# EAGLE schematic Mainboard_schematic (EAGLE 9.7.0)
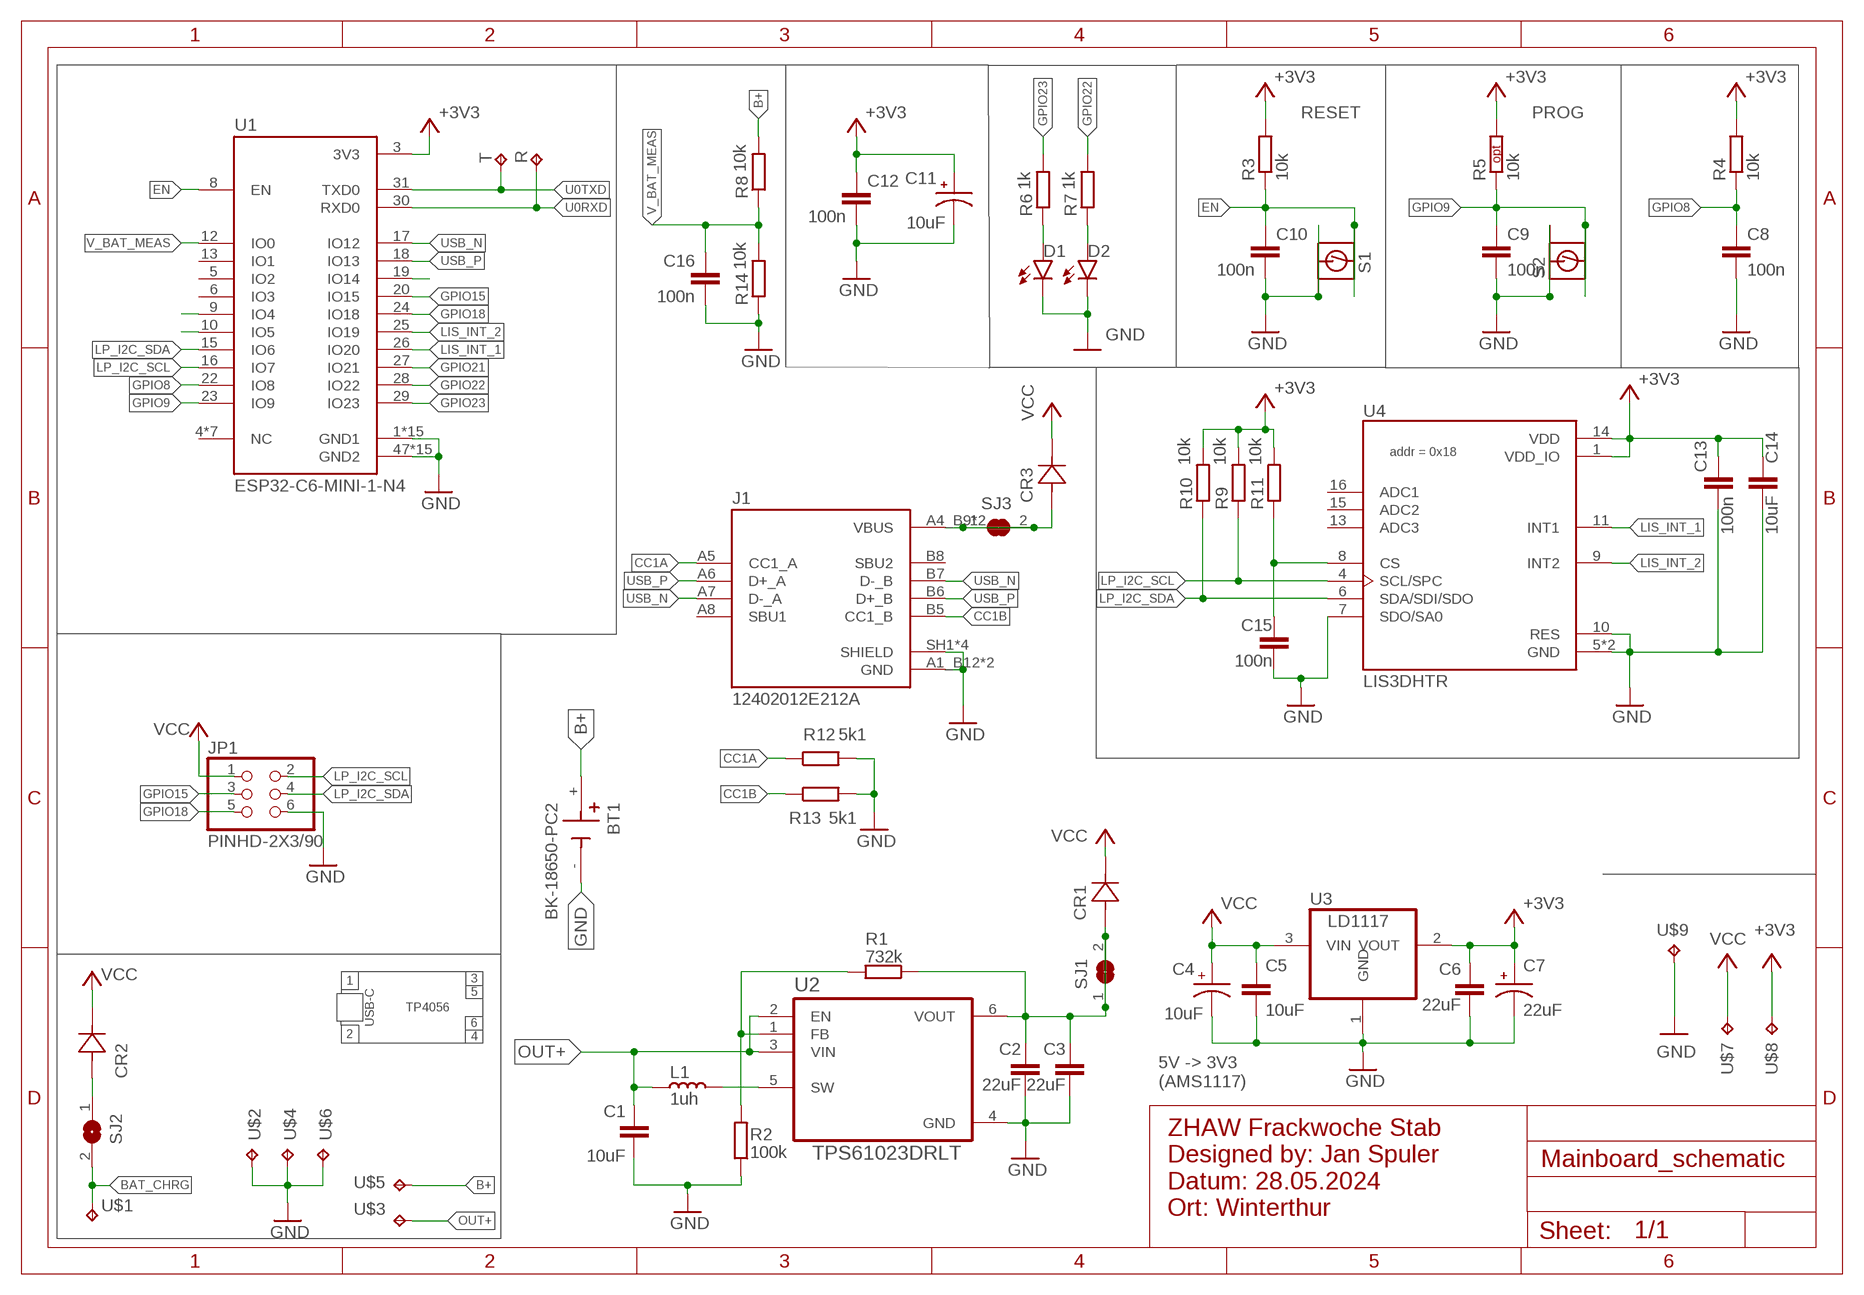
[diagram p0: schematic, sheet 1]

## Parts
BT1  BK-18650-PC2  [BAT_BK-18650-PC2]
C1  10uF  C-EUC0603  [C0603]
C2  22uF  C-EUC0603  [C0603]
C3  22uF  C-EUC0603  [C0603]
C4  10uF  50SVPF10M  [CAP_50SVPF10M]
C5  10uF  C-EUC0603  [C0603]
C6  22uF  C-EUC0603  [C0603]
C7  22uF  50SVPF10M  [CAP_50SVPF10M]
C8  100n  C-EUC0603  [C0603]
C9  100n  C-EUC0603  [C0603]
C10  100n  C-EUC0603  [C0603]
C11  10uF  50SVPF10M  [CAP_50SVPF10M]
C12  100n  C-EUC0603  [C0603]
C13  100n  C-EUC0603  [C0603]
C14  10uF  C-EUC0603  [C0603]
C15  100n  C-EUC0603  [C0603]
C16  100n  C-EUC0603  [C0603]
CR1  LSM115JE3/TR13DO-214BA_MCH-M  [DO-214BA_MCH-M]
CR2  LSM115JE3/TR13DO-214BA_MCH-M  [DO-214BA_MCH-M]
CR3  LSM115JE3/TR13DO-214BA_MCH-M  [DO-214BA_MCH-M]
D1  LED_RED  CHIP-FLAT-R_0603-0.55MM  [LEDC1608X55N_FLAT-R]
D2  LED_RED  CHIP-FLAT-R_0603-0.55MM  [LEDC1608X55N_FLAT-R]
J1  12402012E212A  [AMPHENOL_12402012E212A]
JP1  PINHD-2X3/90  [2X03/90]
L1  1uh  INDUCTOR_INDUCTOR/FERRITE-BEAD0806  [INDUCTOR_L0806]
R  TESTPAD  [TESTPAD_HOLE]
R1  732k  R-EU_R0603  [R0603]
R2  100k  R-EU_R0603  [R0603]
R3  10k  R-EU_R0603  [R0603]
R4  10k  R-EU_R0603  [R0603]
R5  10k  R-EU_R0603  [R0603]
R6  1k  R-EU_R0603  [R0603]
R7  1k  R-EU_R0603  [R0603]
R8  10k  R-EU_R0603  [R0603]
R9  10k  R-EU_R0603  [R0603]
R10  10k  R-EU_R0603  [R0603]
R11  10k  R-EU_R0603  [R0603]
R12  5k1  R-EU_R0603  [R0603]
R13  5k1  R-EU_R0603  [R0603]
R14  10k  R-EU_R0603  [R0603]
S1  PTS645SM43SMTR92LFS  [PTS645-SMT-6MM]
S2  PTS645SM43SMTR92LFS  [PTS645-SMT-6MM]
SJ1  SJ  [SJ]
SJ2  SJ  [SJ]
SJ3  SJ  [SJ]
T  TESTPAD  [TESTPAD_HOLE]
U1  ESP32-C6-MINI-1-N4  [XCVR_ESP32-C6-MINI-1-N4]
U2  TPS61023DRLT  [SOT50P160X60-6N]
U3  LD1117  [SOT223]
U4  LIS3DHTR  [XDCR_LIS3DHTR]
U$1  PIN_1X1X2.56  [HOLE_1MM]
U$2  PIN_1X1X2.56  [HOLE_1MM]
U$3  PIN_1X1X2.56  [HOLE_1MM]
U$4  PIN_1X1X2.56  [HOLE_1MM]
U$5  PIN_1X1X2.56  [HOLE_1MM]
U$6  PIN_1X1X2.56  [HOLE_1MM]
U$7  TESTPAD  [TESTPAD_HOLE]
U$8  TESTPAD  [TESTPAD_HOLE]
U$9  TESTPAD  [TESTPAD_HOLE]

## Nets
+3V3: C6.1 C7.1 C11.1 C12.1 C13.1 C14.1 R3.2 R4.2 R5.2 R9.2 R10.2 R11.2 U1.3(3V3) U3.2(VOUT) U4.1(VDD_IO) U4.14(VDD) U$8.TP
B+: BT1.+ R8.2 U$5.P$1(TP)
BAT_CHRG: SJ2.2 U$1.P$1(TP)
CC1A: J1.A5(CC1_A) R12.1
CC1B: J1.B5(CC1_B) R13.1
EN: C10.1 R3.1 S1.P$3 S1.P$4 U1.8(EN)
GND: BT1.- C1.2 C2.2 C3.2 C4.2 C5.2 C6.2 C7.2 C8.2 C9.2 C10.2 C11.2 C12.2 C13.2 C14.2 C15.2 C16.2 D1.C D2.C J1.A1_B12(GND) J1.B1_A12(GND) J1.SH1(SHIELD) J1.SH2(SHIELD) J1.SH3(SHIELD) J1.SH4(SHIELD) JP1.6 R2.1 R12.2 R13.2 R14.1 S1.P$1 S1.P$2 S2.P$1 S2.P$2 U1.1(GND1) U1.2(GND1) U1.11(GND1) U1.14(GND1) U1.36(GND1) U1.37(GND1) U1.38(GND1) U1.39(GND1) U1.40(GND1) U1.41(GND1) U1.42(GND1) U1.43(GND1) U1.44(GND1) U1.45(GND1) U1.46(GND1) U1.47(GND2) U1.48(GND2) U1.49_1(GND2) U1.49_2(GND2) U1.49_3(GND2) U1.49_4(GND2) U1.49_5(GND2) U1.49_6(GND2) U1.49_7(GND2) U1.49_8(GND2) U1.49_9(GND2) U1.50(GND2) U1.51(GND2) U1.52(GND2) U1.53(GND2) U2.4(GND) U3.1(GND) U4.5(GND) U4.7(SDO/SA0) U4.10(RES) U4.12(GND) U$2.P$1(TP) U$4.P$1(TP) U$6.P$1(TP) U$9.TP
GPIO8: C8.1 R4.1 U1.22(IO8)
GPIO9: C9.1 R5.1 S2.P$3 S2.P$4 U1.23(IO9)
GPIO15: JP1.3 U1.20(IO15)
GPIO18: JP1.5 U1.24(IO18)
GPIO21: U1.27(IO21)
GPIO22: R7.2 U1.28(IO22)
GPIO23: R6.2 U1.29(IO23)
LIS_INT_1: U1.26(IO20) U4.11(INT1)
LIS_INT_2: U1.25(IO19) U4.9(INT2)
LP_I2C_SCL: JP1.2 R9.1 U1.16(IO7) U4.4(SCL/SPC)
LP_I2C_SDA: JP1.4 R10.1 U1.15(IO6) U4.6(SDA/SDI/SDO)
N$1: C2.1 C3.1 CR1.2 R1.1 SJ1.1 SJ1.2 U2.6(VOUT)
N$2: CR2.2 SJ2.1
N$3: L1.2 U2.5(SW)
N$5: R1.2 R2.2 U2.1(FB)
N$7: U1.19(IO14)
N$9: D1.A R6.1
N$10: D2.A R7.1
N$11: U1.10(IO5)
N$12: U1.9(IO4)
N$16: C15.1 R11.1 U4.8(CS)
N$30: CR3.2 J1.A4_B9(VBUS) J1.B4_A9(VBUS) SJ3.1 SJ3.2
OUT+: C1.1 L1.1 U2.2(EN) U2.3(VIN) U$3.P$1(TP)
U0RXD: R.TP U1.30(RXD0)
U0TXD: T.TP U1.31(TXD0)
USB_N: J1.A7(D-_A) J1.B7(D-_B) U1.17(IO12)
USB_P: J1.A6(D+_A) J1.B6(D+_B) U1.18(IO13)
V_BAT_MEAS: C16.1 R8.1 R14.2 U1.12(IO0)
VCC: C4.1 C5.1 CR1.1 CR2.1 CR3.1 JP1.1 U3.3(VIN) U$7.TP
Unconnected: J1.A8(SBU1) J1.B8(SBU2) U1.4(NC) U1.5(IO2) U1.6(IO3) U1.7(NC) U1.13(IO1) U1.21(NC) U1.32(NC) U1.33(NC) U1.34(NC) U1.35(NC) U4.13(ADC3) U4.15(ADC2) U4.16(ADC1)

## Notes on the sheet
- RESET | PROG
- opt
- addr = 0x18
- 1 | 3
- 5
- USB-C | TP4056
- 6
- 2 | 4
- 5V -> 3V3
  (AMS1117)
- ZHAW Frackwoche Stab
  Designed by: Jan Spuler
  Datum: 28.05.2024
  Ort: Winterthur

## Library data of the parts
BT1 = BK-18650-PC2:BK-18650-PC2: Battery Holder (Open) 18650 1 Cell PC Pin; MANUFACTURER: MPD; MAXIMUM_PACKAGE_HEIGHT: 21.41 mm; PARTREV: F; STANDARD: Manufacturer Recommendations
C1-C3 C5 C6 C8-C10 C12-C16 = rcl:C-EU: CAPACITOR, European symbol; SPICEPREFIX: C
C4 C7 C11 = 50SVPF10M:50SVPF10M; MANUFACTURER: Panasonic; MAXIMUM_PACKAGE_HEIGHT: 5.9mm; PARTREV: 28-Jun-19; STANDARD: Manufacturer Recommendations
CR1-CR3 = 2024-05-29_14-46-41_Library:LSM115JE3/TR13; COPYRIGHT: Copyright (C) 2024 Ultra Librarian. All rights reserved.; MANUFACTURER_PART_NUMBER: LSM115JE3/TR13; MFR_NAME: Microchip
D1 D2 = LED:CHIP-FLAT-R; CATEGORY: LED; COLOR: RED; DESCRIPTION: CHIP LED FLAT; SUB-CATEGORY: CHIP; TYPE: FLAT_TOP
J1 = 12402012E212A:12402012E212A; MANUFACTURER: Amphenol; MAXIMUM_PACKAGE_HEIGHT: 3.26 mm; PARTREV: 4; STANDARD: Manufacturer Recommendations
JP1 = Connector:PINHD-2X3: PIN HEADER; CATEGORY: Headers; DESCRIPTION: Header, Right Angle, 2x3 Position; MANUFACTURER: Generic; MPN: Generic; OPERATING_TEMPERATURE: Generic; PART_STATUS: Active; PITCH: 0.100" (2.54mm); ROHS_COMPLIANCE: Generic; SERIES: Generic; SUB-CATEGORY: Headers, Male Pins; TYPE: Board to Board or Cable, Unshrouded, Through Hole, Right Angle
L1 = BeagleBone_Blue_R3:INDUCTOR_INDUCTOR/FERRITE-BEAD
R T U$7-U$9 = hbli8971:TESTPAD
R1-R14 = rcl:R-EU_: RESISTOR, European symbol; SPICEPREFIX: R
S1 S2 = hbli8971:PTS645SM43SMTR92LFS
SJ1-SJ3 = jumper:SJ: SMD solder JUMPER
U1 = ESP32-C6-MINI-1-N4:ESP32-C6-MINI-1-N4; MANUFACTURER: Espressif Systems; MAXIMUM_PACKAGE_HEIGHT: 2.55 mm; PARTREV: 1.0; STANDARD: Manufacturer recommendations
U2 = TPS61023DRLT:TPS61023DRLT
U3 = PulseOximeterECG_AU:LD1117: 800mA and 1A Low Dropout (LDO) Positive Regulator 1.8V, 2.5V, 2.85V, 3.3V, 5V, and Adj; MF: TEXAS INSTRUMENTS; MPN: REG1117FAKTTT; OC_FARNELL: 1296120; OC_NEWARK: 87H2562
U4 = LIS3DHTR:LIS3DHTR: MEMS digital output motion sensor ultra low-power high performance 3-axes "nano" accelerometer; MANUFACTURER: STMicroelectronics; MAXIMUM_PACKAGE_HEIGHT: 1mm; PARTREV: 2; STANDARD: Manufacturer Recommendations
U$1-U$6 = hbli8971:PIN_1X1X2.56